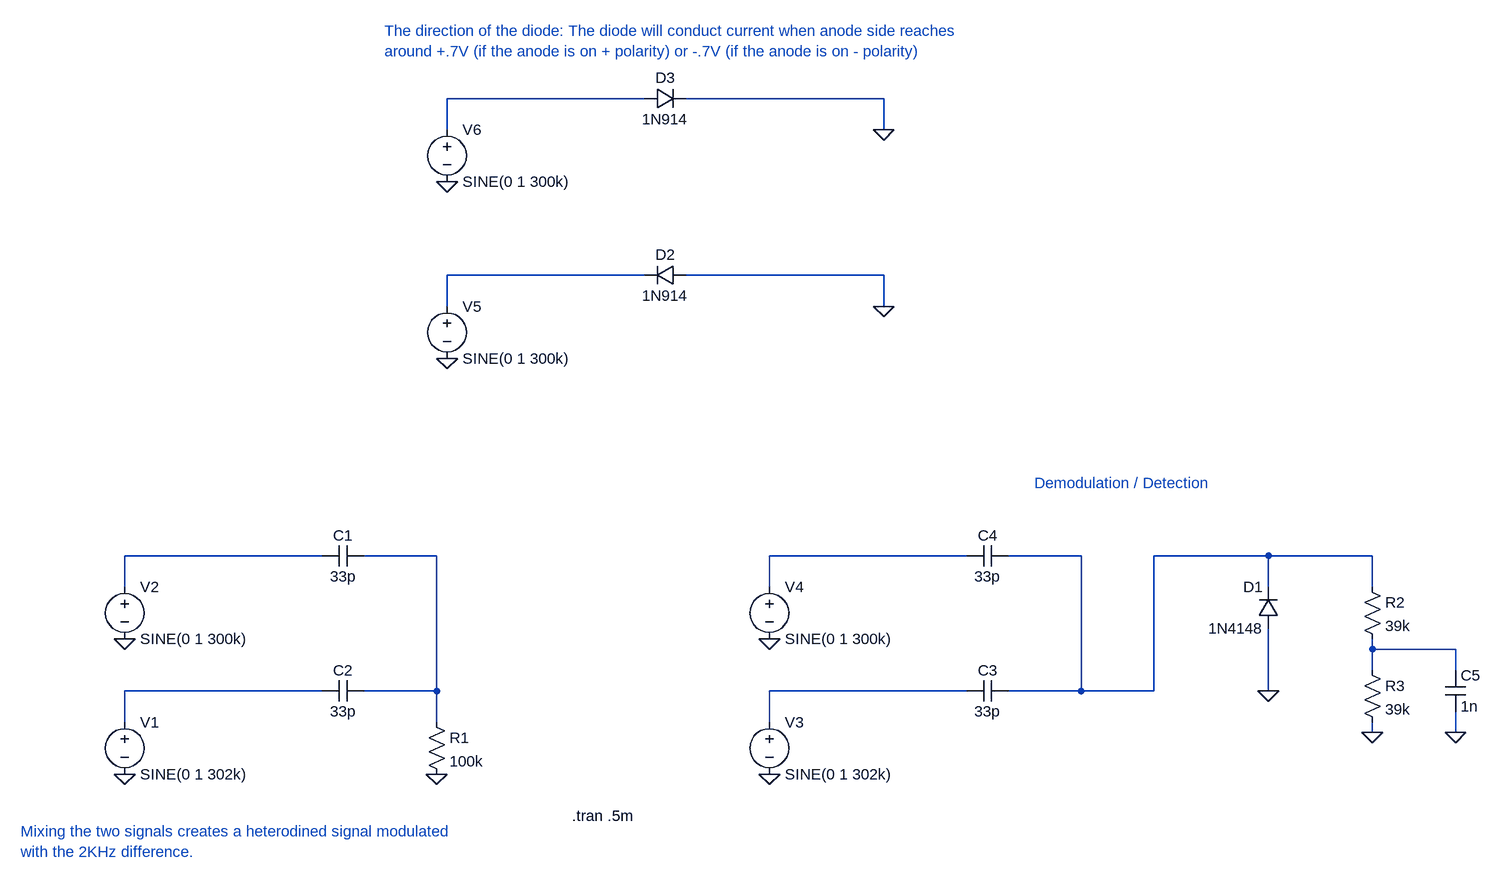
[diagram p0: schematic Heterodine.asc]
Heterodine.asc, the LTspice schematic file:
Version 4
SHEET 1 2232 680
WIRE 944 -784 640 -784
WIRE 1312 -784 1008 -784
WIRE 640 -736 640 -784
WIRE 1312 -736 1312 -784
WIRE 944 -512 640 -512
WIRE 1312 -512 1008 -512
WIRE 640 -464 640 -512
WIRE 1312 -464 1312 -512
WIRE 448 -80 144 -80
WIRE 624 -80 512 -80
WIRE 1440 -80 1136 -80
WIRE 1616 -80 1504 -80
WIRE 1904 -80 1728 -80
WIRE 2064 -80 1904 -80
WIRE 144 -32 144 -80
WIRE 1136 -32 1136 -80
WIRE 1904 -32 1904 -80
WIRE 2064 -32 2064 -80
WIRE 2064 64 2064 48
WIRE 2192 64 2064 64
WIRE 2064 96 2064 64
WIRE 2192 96 2192 64
WIRE 448 128 144 128
WIRE 624 128 624 -80
WIRE 624 128 512 128
WIRE 1440 128 1136 128
WIRE 1616 128 1616 -80
WIRE 1616 128 1504 128
WIRE 1728 128 1728 -80
WIRE 1728 128 1616 128
WIRE 1904 128 1904 32
WIRE 144 176 144 128
WIRE 624 176 624 128
WIRE 1136 176 1136 128
WIRE 2064 192 2064 176
WIRE 2192 192 2192 160
FLAG 144 48 0
FLAG 144 256 0
FLAG 624 256 0
FLAG 1136 48 0
FLAG 1136 256 0
FLAG 1904 128 0
FLAG 2064 192 0
FLAG 2192 192 0
FLAG 640 -384 0
FLAG 1312 -464 0
FLAG 640 -656 0
FLAG 1312 -736 0
SYMBOL voltage 144 160 R0
WINDOW 123 0 0 Left 0
WINDOW 39 0 0 Left 0
SYMATTR InstName V1
SYMATTR Value SINE(0 1 302k)
SYMBOL voltage 144 -48 R0
WINDOW 123 0 0 Left 0
WINDOW 39 0 0 Left 0
SYMATTR InstName V2
SYMATTR Value SINE(0 1 300k)
SYMBOL cap 512 112 R90
WINDOW 0 0 32 VBottom 2
WINDOW 3 32 32 VTop 2
SYMATTR InstName C2
SYMATTR Value 33p
SYMBOL res 608 160 R0
SYMATTR InstName R1
SYMATTR Value 100k
SYMBOL cap 512 -96 R90
WINDOW 0 0 32 VBottom 2
WINDOW 3 32 32 VTop 2
SYMATTR InstName C1
SYMATTR Value 33p
SYMBOL voltage 1136 160 R0
WINDOW 123 0 0 Left 0
WINDOW 39 0 0 Left 0
SYMATTR InstName V3
SYMATTR Value SINE(0 1 302k)
SYMBOL voltage 1136 -48 R0
WINDOW 123 0 0 Left 0
WINDOW 39 0 0 Left 0
SYMATTR InstName V4
SYMATTR Value SINE(0 1 300k)
SYMBOL cap 1504 112 R90
WINDOW 0 0 32 VBottom 2
WINDOW 3 32 32 VTop 2
SYMATTR InstName C3
SYMATTR Value 33p
SYMBOL cap 1504 -96 R90
WINDOW 0 0 32 VBottom 2
WINDOW 3 32 32 VTop 2
SYMATTR InstName C4
SYMATTR Value 33p
SYMBOL diode 1920 32 R180
WINDOW 0 24 64 Left 2
WINDOW 3 24 0 Left 2
SYMATTR InstName D1
SYMATTR Value 1N4148
SYMBOL res 2048 -48 R0
SYMATTR InstName R2
SYMATTR Value 39k
SYMBOL cap 2176 96 R0
SYMATTR InstName C5
SYMATTR Value 1n
SYMBOL res 2048 80 R0
SYMATTR InstName R3
SYMATTR Value 39k
SYMBOL voltage 640 -480 R0
WINDOW 123 0 0 Left 0
WINDOW 39 0 0 Left 0
SYMATTR InstName V5
SYMATTR Value SINE(0 1 300k)
SYMBOL diode 1008 -528 R90
WINDOW 0 0 32 VBottom 2
WINDOW 3 32 32 VTop 2
SYMATTR InstName D2
SYMATTR Value 1N914
SYMBOL voltage 640 -752 R0
WINDOW 123 0 0 Left 0
WINDOW 39 0 0 Left 0
SYMATTR InstName V6
SYMATTR Value SINE(0 1 300k)
SYMBOL diode 944 -768 R270
WINDOW 0 32 32 VTop 2
WINDOW 3 0 32 VBottom 2
SYMATTR InstName D3
SYMATTR Value 1N914
TEXT 832 320 Left 2 !.tran .5m
TEXT 1544 -192 Left 2 ;Demodulation / Detection
TEXT -16 344 Left 2 ;Mixing the two signals creates a heterodined signal modulated\nwith the 2KHz difference.
TEXT 544 -888 Left 2 ;The direction of the diode: The diode will conduct current when anode side reaches\naround +.7V (if the anode is on + polarity) or -.7V (if the anode is on - polarity)

The netlist it stands for:
* Heterodine.asc
V1 N008 0 SINE(0 1 302k)
V2 N003 0 SINE(0 1 300k)
C2 N004 N008 33p
R1 N004 0 100k
C1 N004 N003 33p
V3 N009 0 SINE(0 1 302k)
V4 N005 0 SINE(0 1 300k)
C3 N006 N009 33p
C4 N006 N005 33p
D1 0 N006 1N4148
R2 N006 N007 39k
C5 N007 0 1n
R3 N007 0 39k
V5 N002 0 SINE(0 1 300k)
D2 0 N002 1N914
V6 N001 0 SINE(0 1 300k)
D3 N001 0 1N914
.model D D
.lib standard.dio
.tran .5m
* Demodulation / Detection
* Mixing the two signals creates a heterodined signal modulated
* with the 2KHz difference.
* The direction of the diode: The diode will conduct current when anode side reaches
* around +.7V (if the anode is on + polarity) or -.7V (if the anode is on - polarity)
.backanno
.end